# Altium schematic sheet MPU_Schem.SchDoc
size A; SheetNumber: 4; SheetTotal: 6
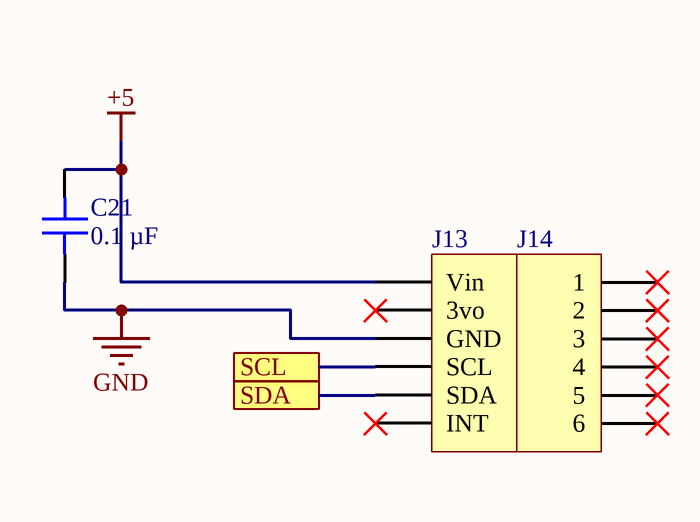
[diagram p0: MPU_Schem.SchDoc]

## Parts
C21  0.1 µF  [CAP 1206_3216 - 0.8MM]
J13  (no value)  [HDR1X6]
J14  (no value)  [HDR1X6]

## Ports
SCL, SDA

## Nets
+5: C21.2 J13.1(Vin)
GND: C21.1 J13.3(GND)
SCL: J13.4(SCL) ; port SCL
SDA: J13.5(SDA) ; port SDA

Not connected (* = marked no-connect by the designer): J13 2(3vo)* 6(INT)*; J14 1* 2* 3* 4* 5* 6*

## Library data of the parts
C21 = CC1206ZRY5V9BB104: CAP CER 0.1UF 50V Y5V 1206; manufacturer: Yageo; Temperature Coefficient: Y5V (F); Tolerance: -20%, +80%; Part Number: CC1206ZRY5V9BB104; Value: 0.1 µF; Applications: General Purpose; Capacitance: 0.1 µF; componentlink1description: Datasheet; componentlink1url: http://www.yageo.com/NewPortal/_en/search/productDocs.jsp?YageoPartNumber=CC1206ZRY5V9BB104; componentlink2description: DigiKey Link; componentlink2url: https://www.digikey.com/en/products/detail/yageo/CC1206ZRY5V9BB104/5884687; Device Package: 1206 (3216 Metric); lastupdated: 9/19/2022 1:06:25 PM; Lifecycle Status: Active; Minimum Order: 1; Mounting Type: Surface Mount, MLCC; Operating Temperature: -30°C ~ 85°C; Package / Case: 1206 (3216 Metric); packaging: TapeAndReel; partid: 18813; Part Status: Active; price: 0.04; series: CC; Size / Dimension: 0.126" L x 0.063" W (3.20mm x 1.60mm); Supplier 1: DigiKey; Supplier Part Number 1: 311-4505-1-ND; Thickness (Max): 0.028" (0.70mm); Voltage - Rated: 50V
J13 J14 = Header 6: Header, 6-Pin; LatestRevisionDate: 17-Jul-2002; LatestRevisionNote: Re-released for DXP Platform.; Publisher: Altium Limited